# EAGLE schematic sensor-board2 (EAGLE 7.6.0)
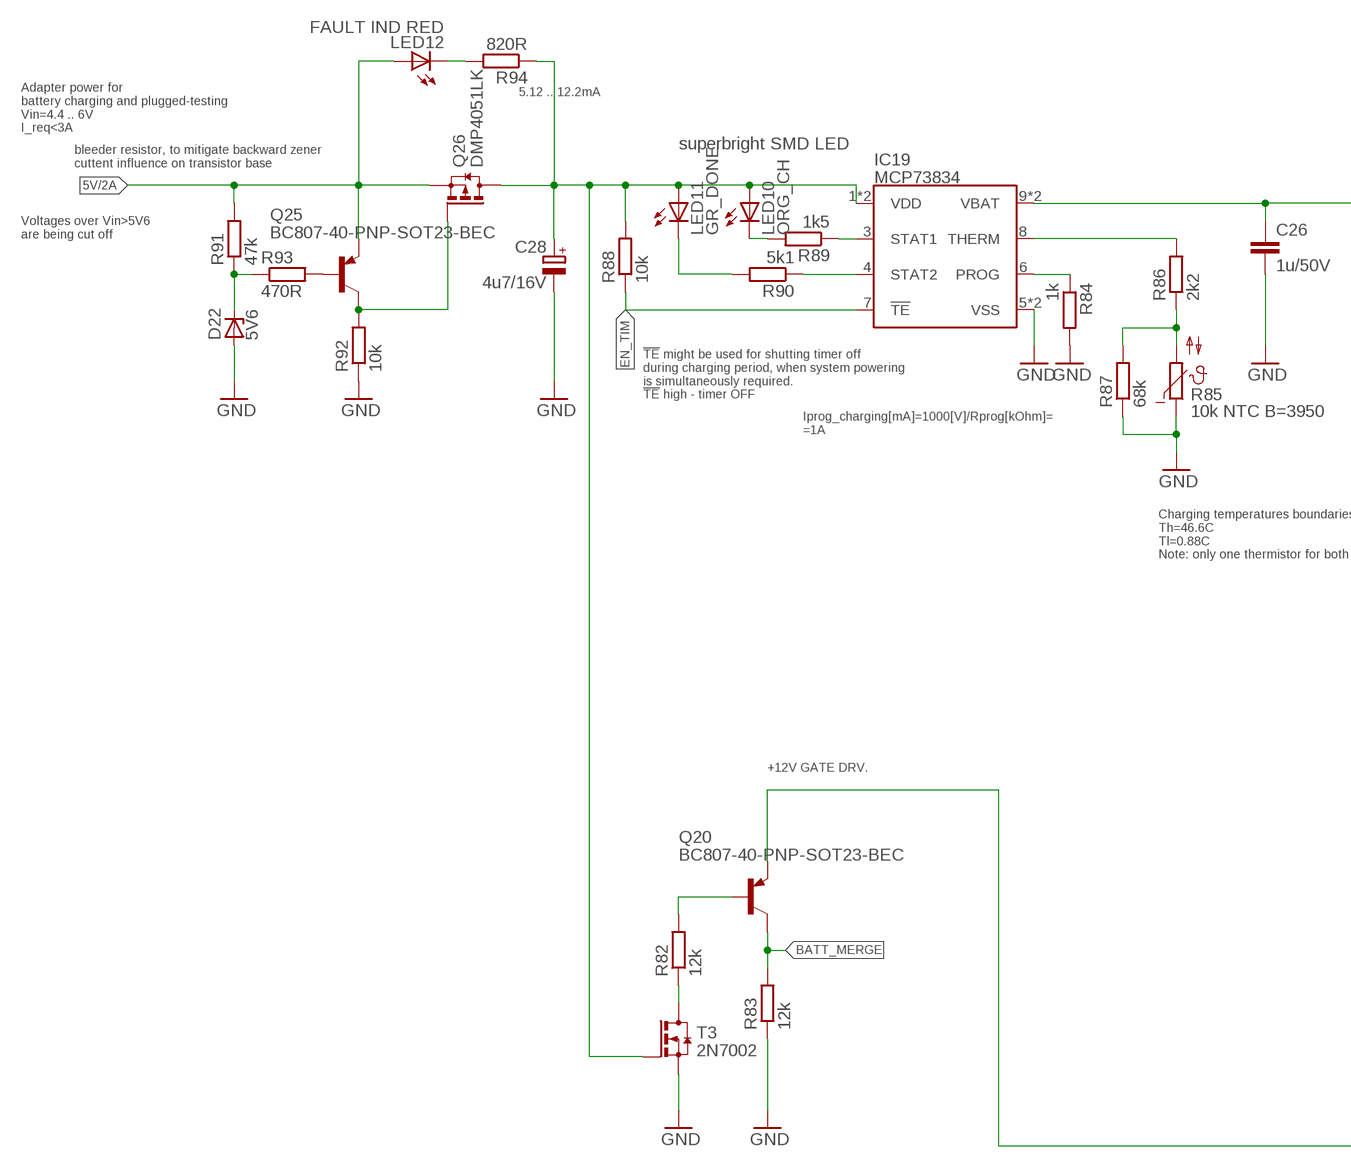
[diagram p0: schematic, sheet 1, part 1 of 3]
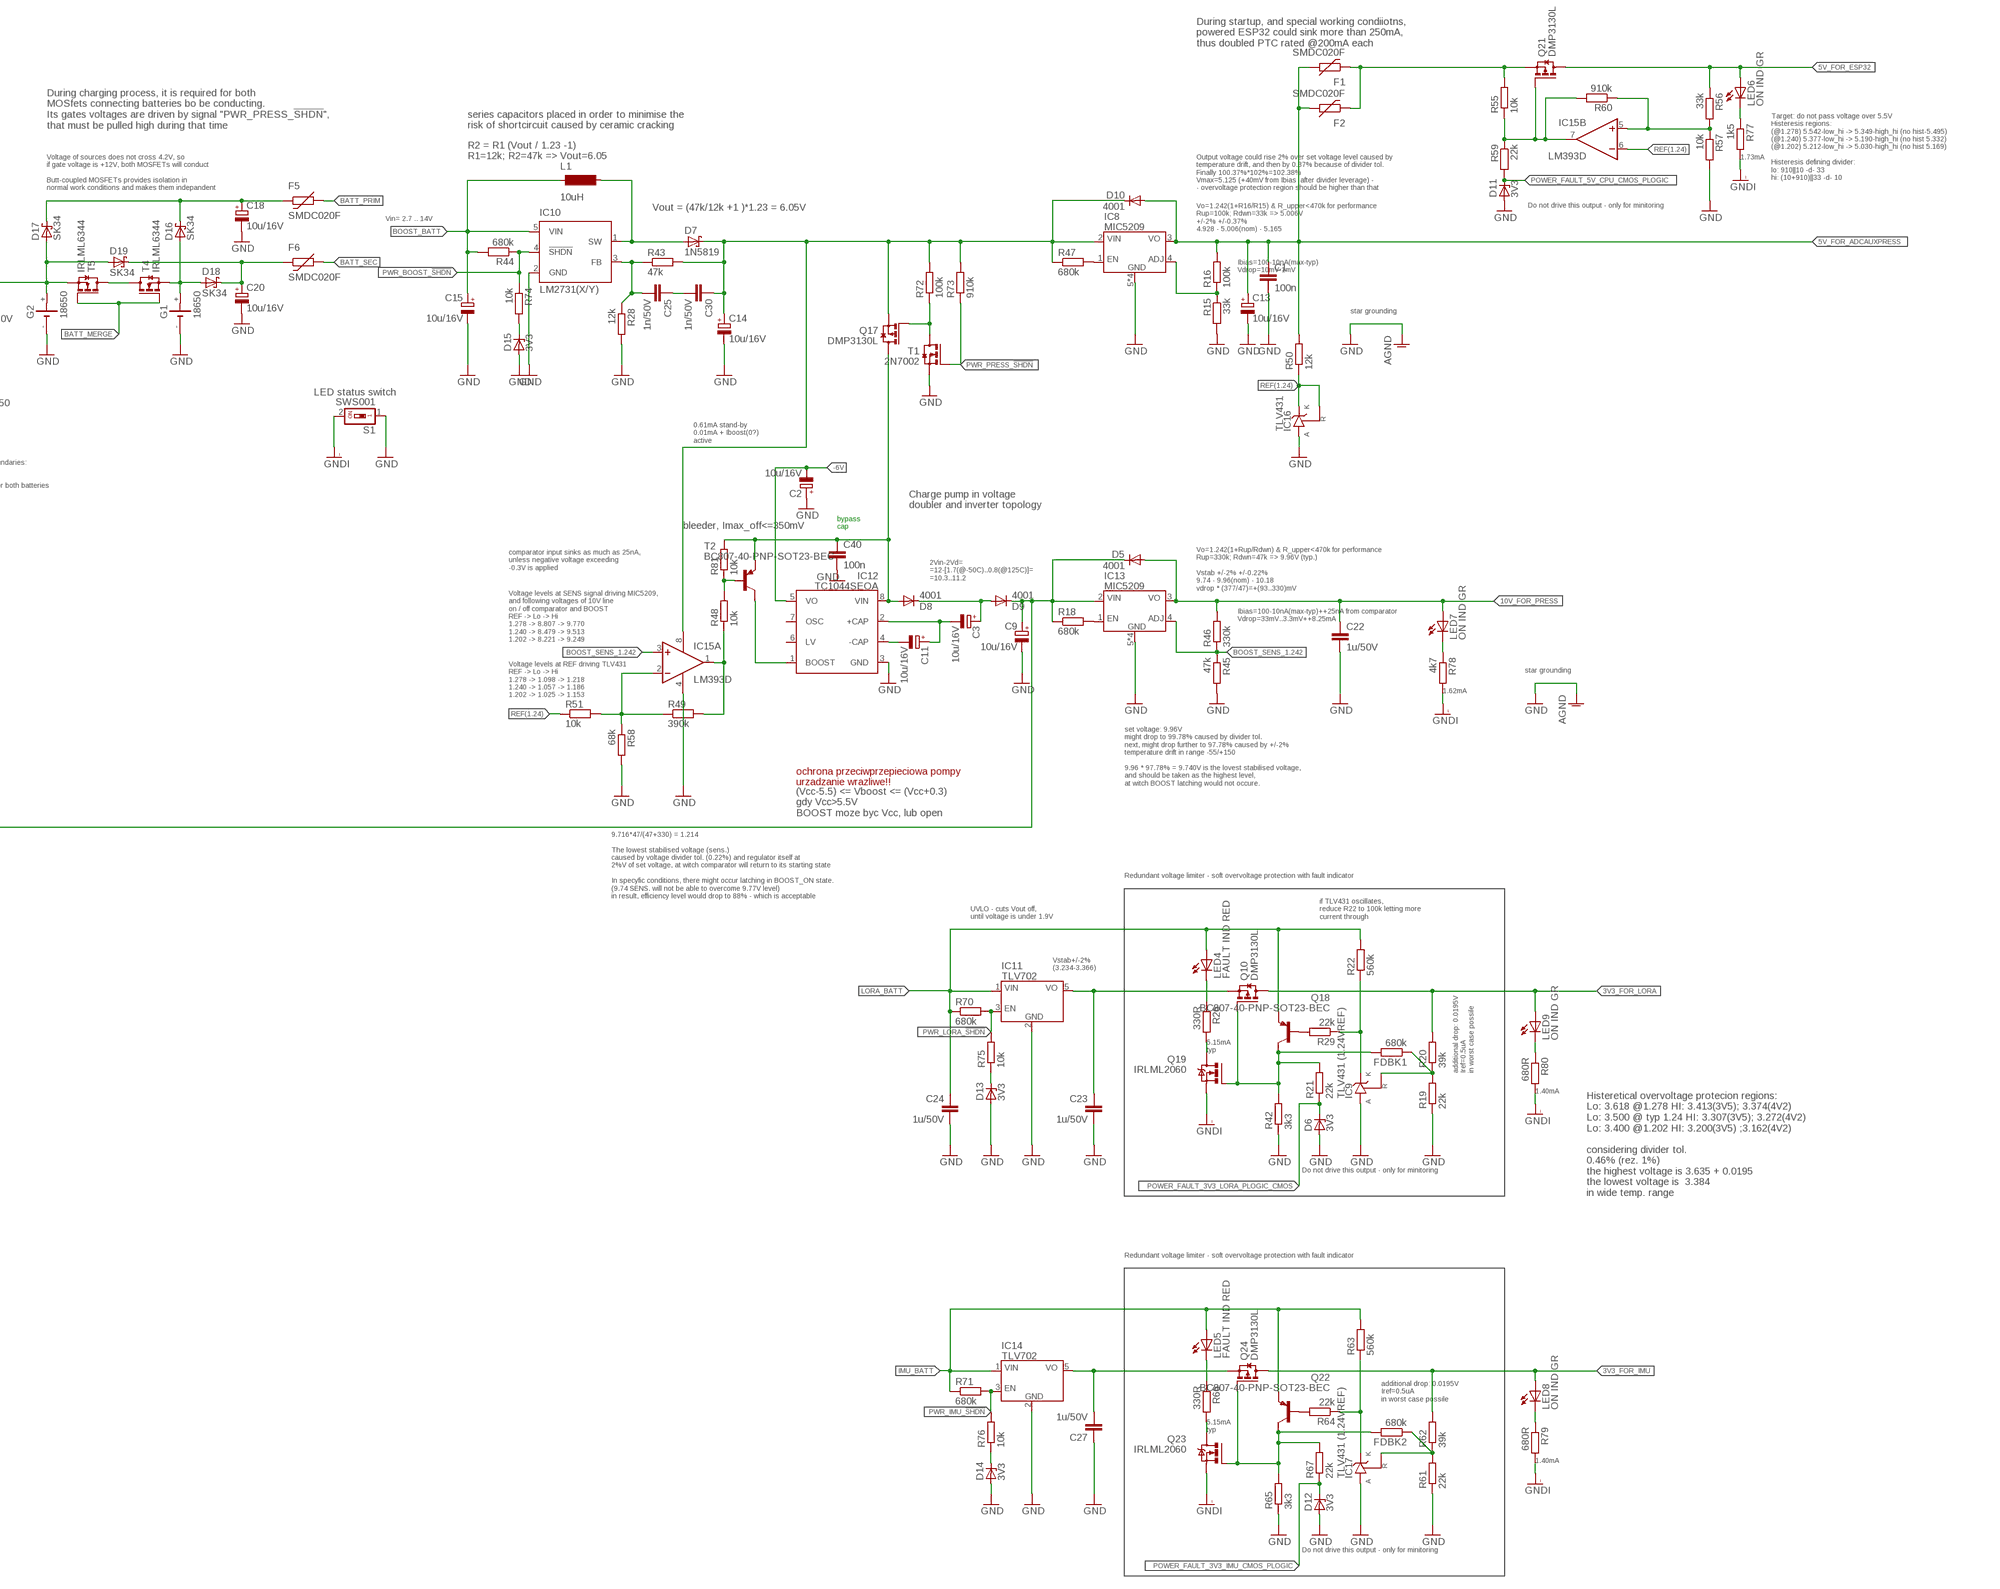
[diagram p1: schematic, sheet 1, part 2 of 3]
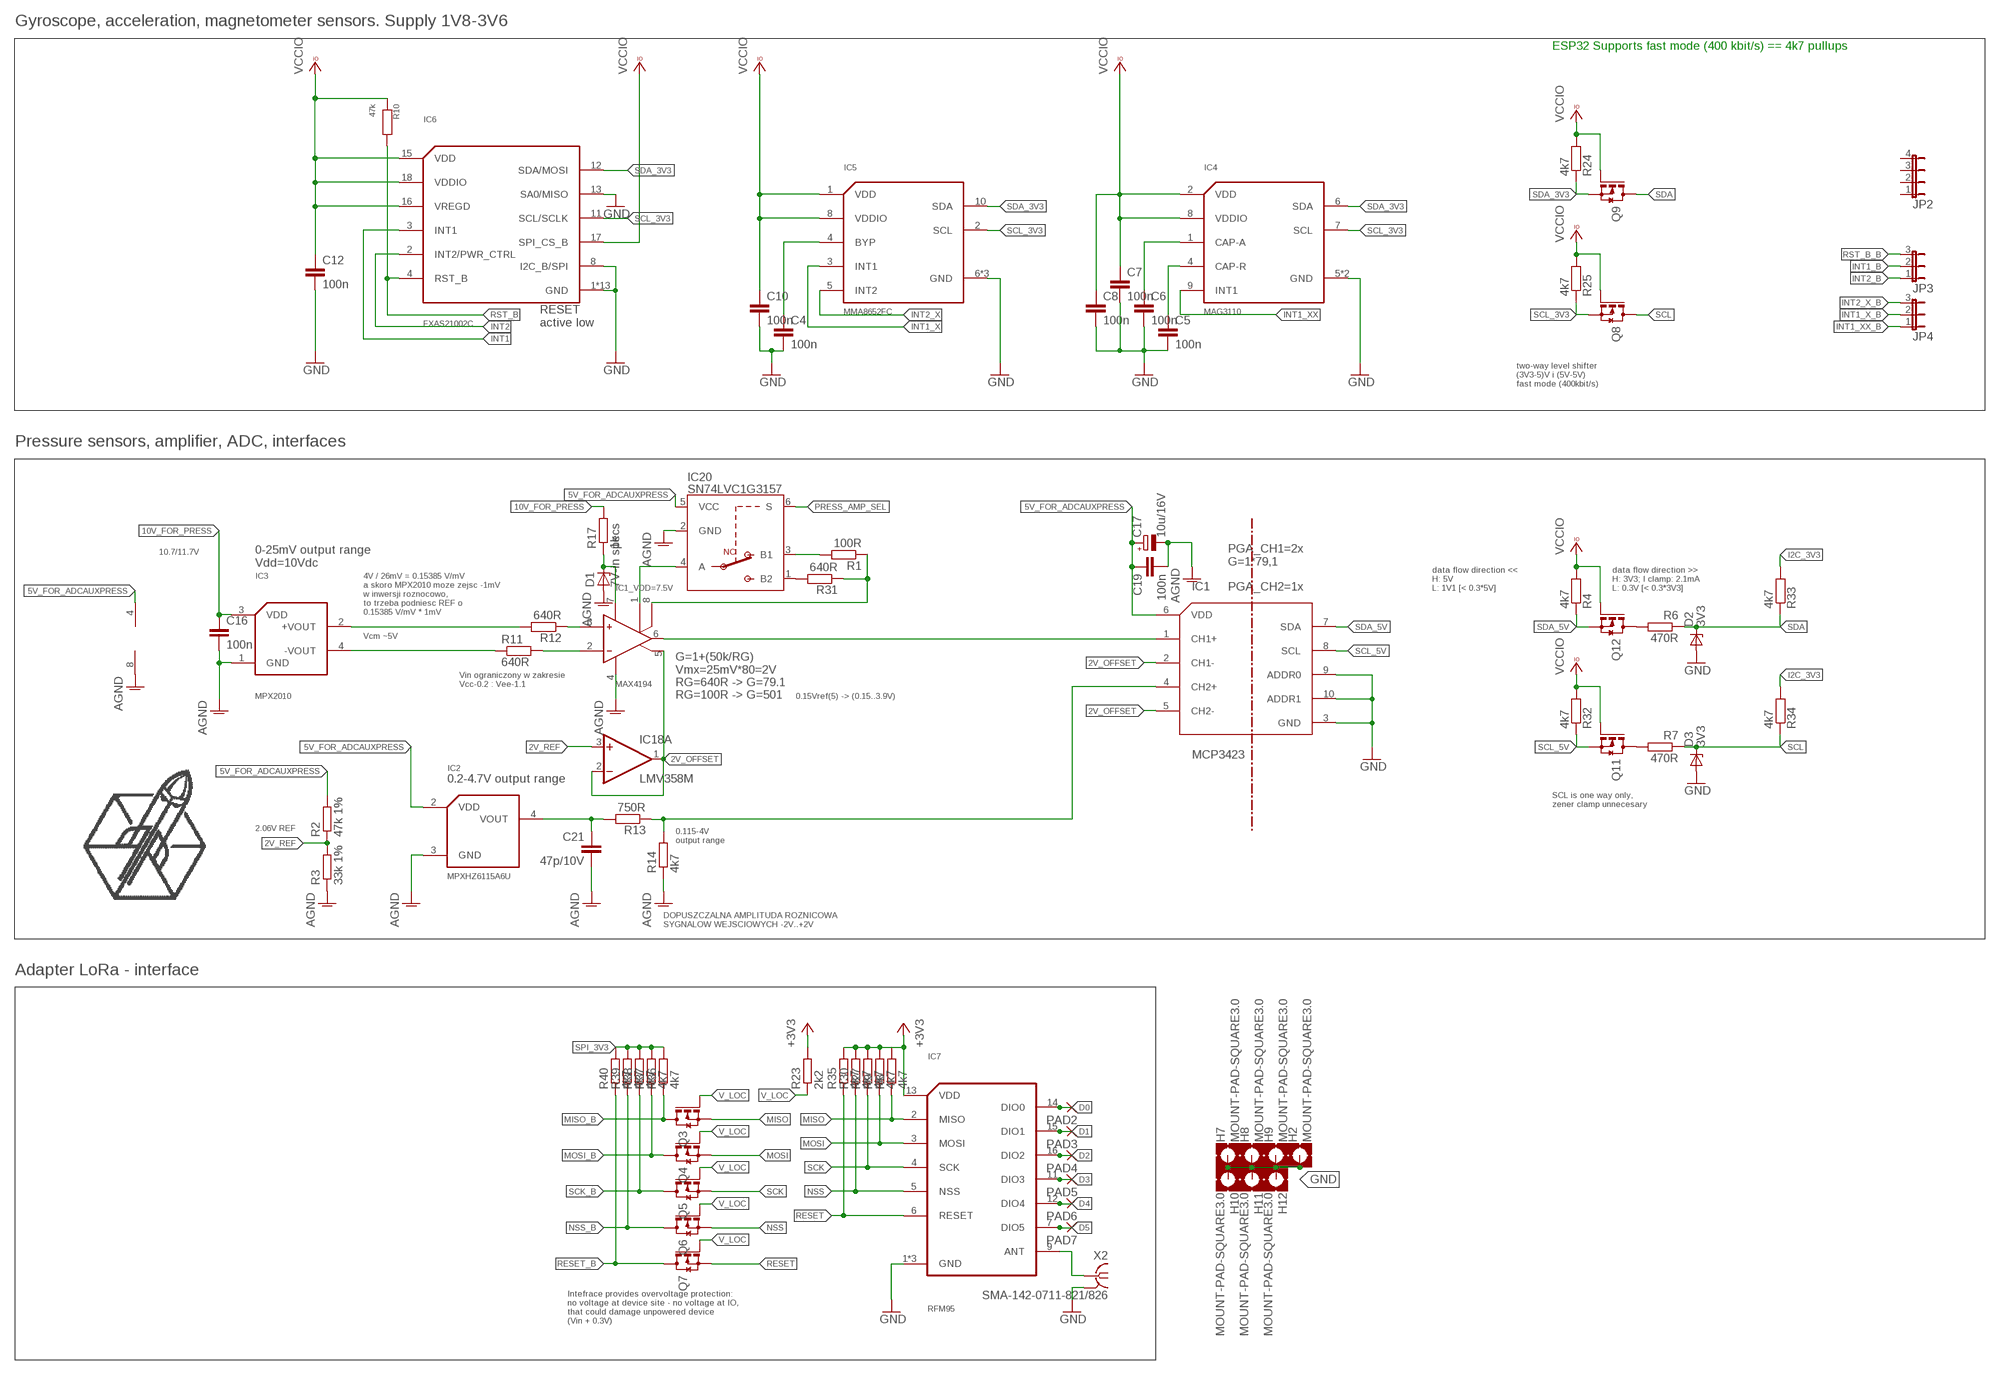
[diagram p2: schematic, sheet 1, part 3 of 3]

## Parts
C1  100n  C-EUC0805  [C0805]
C2  10u/16V  TANTAL_POLY"3218"  [TANTAL"3216"]
C3  10u/16V  TANTAL_POLY"3218"  [TANTAL"3216"]
C4  100n  C-EUC0805  [C0805]
C5  100n  C-EUC0805  [C0805]
C6  100n  C-EUC0805  [C0805]
C7  100n  C-EUC0805  [C0805]
C8  100n  C-EUC0805  [C0805]
C9  10u/16V  TANTAL_POLY"3218"  [TANTAL"3216"]
C10  100n  C-EUC0805  [C0805]
C11  10u/16V  TANTAL_POLY"3218"  [TANTAL"3216"]
C12  100n  C-EUC0805  [C0805]
C13  10u/16V  TANTAL_POLY"3218"  [TANTAL"3216"]
C14  10u/16V  TANTAL_POLY"3218"  [TANTAL"3216"]
C15  10u/16V  TANTAL_POLY"3218"  [TANTAL"3216"]
C16  100n  C-EUC0805  [C0805]
C17  10u/16V  TANTAL_POLY"3218"  [TANTAL"3216"]
C18  10u/16V  TANTAL_POLY"3218"  [TANTAL"3216"]
C19  100n  C-EUC0805  [C0805]
C20  10u/16V  TANTAL_POLY"3218"  [TANTAL"3216"]
C21  47p/10V  C-EUC0805  [C0805]
C22  1u/50V  C-EUC1206  [C1206]
C23  1u/50V  C-EUC1206  [C1206]
C24  1u/50V  C-EUC1206  [C1206]
C25  1n/50V  C-EUC1206  [C1206]
C26  1u/50V  C-EUC1206  [C1206]
C27  1u/50V  C-EUC1206  [C1206]
C28  4u7/16V  TANTAL_POLY"3218"  [TANTAL"3216"]
C30  1n/50V  C-EUC1206  [C1206]
C40  100n  C-EUC0805  [C0805]
D1  7V-in specs  ZENER-DIODESOD80C  [SOD80C]
D2  3V3  1N4148  [SOD323]
D3  3V3  1N4148  [SOD323]
D5  4001  DIODE-DO-214AC  [DO-214AC]
D6  3V3  ZENER-DIODESOD80C  [SOD80C]
D7  1N5819  [MELF-MLL41]
D8  4001  DIODE-DO-214AC  [DO-214AC]
D9  4001  DIODE-DO-214AC  [DO-214AC]
D10  4001  DIODE-DO-214AC  [DO-214AC]
D11  3V3  ZENER-DIODESOD80C  [SOD80C]
D12  3V3  ZENER-DIODESOD80C  [SOD80C]
D13  3V3  ZENER-DIODESOD80C  [SOD80C]
D14  3V3  ZENER-DIODESOD80C  [SOD80C]
D15  3V3  ZENER-DIODESOD80C  [SOD80C]
D16  SK34  [SMA(DO214-AC)]
D17  SK34  [SMA(DO214-AC)]
D18  SK34  [SMA(DO214-AC)]
D19  SK34  [SMA(DO214-AC)]
D22  5V6  ZENER-DIODESOD80C  [SOD80C]
F1  SMDC020F  [1812]
F2  SMDC020F  [1812]
F5  SMDC020F  [1812]
F6  SMDC020F  [1812]
FDBK1  680k  R-EU_R0805  [R0805]
FDBK2  680k  R-EU_R0805  [R0805]
G1  18650  SL-150-1/2AA/PR  [SL-150-1/2AA/PR]
G2  18650  SL-150-1/2AA/PR  [SL-150-1/2AA/PR]
H2  MOUNT-PAD-SQUARE3.0  [3,0-PAD-SQUARE]
H7  MOUNT-PAD-SQUARE3.0  [3,0-PAD-SQUARE]
H8  MOUNT-PAD-SQUARE3.0  [3,0-PAD-SQUARE]
H9  MOUNT-PAD-SQUARE3.0  [3,0-PAD-SQUARE]
H10  MOUNT-PAD-SQUARE3.0  [3,0-PAD-SQUARE]
H11  MOUNT-PAD-SQUARE3.0  [3,0-PAD-SQUARE]
H12  MOUNT-PAD-SQUARE3.0  [3,0-PAD-SQUARE]
IC1  MCP3423  [MSOP10]
IC1_VDD=7.5V  MAX4194  [SO-8]
IC2  MPXHZ6115A6U  [SSOP_CASE_1317]
IC3  MPX2010  [SOP_CASE_482/A]
IC4  MAG3110  [10_PIN_QFN_2X2MM]
IC5  MMA8652FC  [10_PIN_QFN_2X2MM]
IC6  FXAS21002C  [24_QFN_4X4MM]
IC7  RFM95  [RFM95]
IC8  MIC5209  [SOIC8]
IC9  TLV431 (1.24VREF)  TL431-ASA  [SOT23-3]
IC10  LM2731(X/Y)  [SOT23-5]
IC11  TLV702  [SOT23-5]
IC12  TC1044SEOA  [SOIC8]
IC13  MIC5209  [SOIC8]
IC14  TLV702  [SOT23-5]
IC15  LM393D  [SO08]
IC16  TLV431  TL431-ASA  [SOT23-3]
IC17  TLV431 (1.24VREF)  TL431-ASA  [SOT23-3]
IC18  LMV358M  [SO08]
IC19  MCP73834  [DFN10-3X3]
IC20  SN74LVC1G3157  [SC70-6]
JP2  JP4E  [JP4]
JP3  JP2E  [JP2]
JP4  JP2E  [JP2]
L1  10uH  POWER_INDUCTOR  [7X7X4]
LED4  FAULT IND RED  LED_E  [LED_1206]
LED5  FAULT IND RED  LED_E  [LED_1206]
LED6  ON IND GR  LED_E  [LED_1206]
LED7  ON IND GR  LED_E  [LED_1206]
LED8  ON IND GR  LED_E  [LED_1206]
LED9  ON IND GR  LED_E  [LED_1206]
LED10  ORG_CH  LED_E  [LED_1206]
LED11  GR_DONE  LED_E  [LED_1206]
LED12  FAULT IND RED  LED_E  [LED_1206]
PAD2  SMD2  [SMD1,27-2,54]
PAD3  SMD2  [SMD1,27-2,54]
PAD4  SMD2  [SMD1,27-2,54]
PAD5  SMD2  [SMD1,27-2,54]
PAD6  SMD2  [SMD1,27-2,54]
PAD7  SMD2  [SMD1,27-2,54]
Q3  AO3402  [SOT23-3]
Q4  AO3402  [SOT23-3]
Q5  AO3402  [SOT23-3]
Q6  AO3402  [SOT23-3]
Q7  AO3402  [SOT23-3]
Q8  AO3402  [SOT23-3]
Q9  AO3402  [SOT23-3]
Q10  DMP3130L  [SOT23-3]
Q11  AO3402  [SOT23-3]
Q12  AO3402  [SOT23-3]
Q17  DMP3130L  [SOT23-3]
Q18  BC807-40-PNP-SOT23-BEC  [SOT23-BEC]
Q19  IRLML2060  [SOT23-3]
Q20  BC807-40-PNP-SOT23-BEC  [SOT23-BEC]
Q21  DMP3130L  [SOT23-3]
Q22  BC807-40-PNP-SOT23-BEC  [SOT23-BEC]
Q23  IRLML2060  [SOT23-3]
Q24  DMP3130L  [SOT23-3]
Q25  BC807-40-PNP-SOT23-BEC  [SOT23-BEC]
Q26  DMP4051LK  [TO252-3-11]
R1  100R  R-EU_R0805  [R0805]
R2  47k 1%  R-EU_R0805  [R0805]
R3  33k 1%  R-EU_R0805  [R0805]
R4  4k7  R-EU_R0805  [R0805]
R6  470R  R-EU_R0805  [R0805]
R7  470R  R-EU_R0805  [R0805]
R8  4k7  R-EU_R0805  [R0805]
R9  4k7  R-EU_R0805  [R0805]
R10  47k  RESISTOR  [ZWORA@1]
R11  640R  R-EU_R0805  [R0805]
R12  640R  R-EU_R0805  [R0805]
R13  750R  R-EU_R0805  [R0805]
R14  4k7  R-EU_R0805  [R0805]
R15  33k  R-EU_R0805  [R0805]
R16  100k  R-EU_R0805  [R0805]
R17  1k  R-EU_R0805  [R0805]
R18  680k  R-EU_R0805  [R0805]
R19  22k  R-EU_R0805  [R0805]
R20  39k  R-EU_R0805  [R0805]
R21  22k  R-EU_R0805  [R0805]
R22  560k  R-EU_R0805  [R0805]
R23  2k2  R-EU_R0805  [R0805]
R24  4k7  R-EU_R0805  [R0805]
R25  4k7  R-EU_R0805  [R0805]
R26  330R  R-EU_R0805  [R0805]
R27  4k7  R-EU_R0805  [R0805]
R28  12k  R-EU_R0805  [R0805]
R29  22k  R-EU_R0805  [R0805]
R30  4k7  R-EU_R0805  [R0805]
R31  640R  R-EU_R0805  [R0805]
R32  4k7  R-EU_R0805  [R0805]
R33  4k7  R-EU_R0805  [R0805]
R34  4k7  R-EU_R0805  [R0805]
R35  4k7  R-EU_R0805  [R0805]
R36  4k7  R-EU_R0805  [R0805]
R37  4k7  R-EU_R0805  [R0805]
R38  4k7  R-EU_R0805  [R0805]
R39  4k7  R-EU_R0805  [R0805]
R40  4k7  R-EU_R0805  [R0805]
R42  3k3  R-EU_R0805  [R0805]
R43  47k  R-EU_R0805  [R0805]
R44  680k  R-EU_R0805  [R0805]
R45  47k  R-EU_R0805  [R0805]
R46  330k  R-EU_R0805  [R0805]
R47  680k  R-EU_R0805  [R0805]
R48  10k  R-EU_R0805  [R0805]
R49  390k  R-EU_R0805  [R0805]
R50  12k  R-EU_R0805  [R0805]
R51  10k  R-EU_R0805  [R0805]
R55  10k  R-EU_R0805  [R0805]
R56  33k  R-EU_R0805  [R0805]
R57  10k  R-EU_R0805  [R0805]
R58  68k  R-EU_R0805  [R0805]
R59  22k  R-EU_R0805  [R0805]
R60  910k  R-EU_R0805  [R0805]
R61  22k  R-EU_R0805  [R0805]
R62  39k  R-EU_R0805  [R0805]
R63  560k  R-EU_R0805  [R0805]
R64  22k  R-EU_R0805  [R0805]
R65  3k3  R-EU_R0805  [R0805]
R66  330R  R-EU_R0805  [R0805]
R67  22k  R-EU_R0805  [R0805]
R70  680k  R-EU_R0805  [R0805]
R71  680k  R-EU_R0805  [R0805]
R72  100k  R-EU_R0805  [R0805]
R73  910k  R-EU_R0805  [R0805]
R74  10k  R-EU_R0805  [R0805]
R75  10k  R-EU_R0805  [R0805]
R76  10k  R-EU_R0805  [R0805]
R77  1k5  R-EU_R0805  [R0805]
R78  4k7  R-EU_R0805  [R0805]
R79  680R  R-EU_R0805  [R0805]
R80  680R  R-EU_R0805  [R0805]
R81  10k  R-EU_R0805  [R0805]
R82  12k  R-EU_R0805  [R0805]
R83  12k  R-EU_R0805  [R0805]
R84  1k  R-EU_R0805  [R0805]
R85  10k NTC B=3950  NTC640-9  [N640]
R86  2k2  R-EU_R0805  [R0805]
R87  68k  R-EU_R0805  [R0805]
R88  10k  R-EU_R0805  [R0805]
R89  1k5  R-EU_R0805  [R0805]
R90  5k1  R-EU_R0805  [R0805]
R91  47k  R-EU_R0805  [R0805]
R92  10k  R-EU_R0805  [R0805]
R93  470R  R-EU_R0805  [R0805]
R94  820R  R-EU_R0805  [R0805]
S1  SWS001  [SMS-001]
T1  2N7002  [SOT23-3W]
T2  BC807-40-PNP-SOT23-BEC  [SOT23-BEC]
T3  2N7002  [SOT23-3W]
T4  IRLML6344  [SOT23-3W@1]
T5  IRLML6344  [SOT23-3W@1]
X2  SMA-142-0711-821/826  [J502-ND-142-0711-821/826]

## Nets
2V_OFFSET: IC1.2(CH1-) IC1.5(CH2-) IC1_VDD=7.5V.5(REF) IC18.1(A:OUT) IC18.2(A:-IN)
2V_REF: IC18.3(A:+IN) R2.1 R3.2
3V3_FOR_IMU: LED8.A Q24.3(D) R62.2
3V3_FOR_LORA: LED9.A Q10.3(D) R20.2
5V/2A: LED12.A Q25.E Q26.2(S) R91.2
5V_FOR_ADCAUXPRESS: C1.1 C13.+ C17.+ C19.1 D10.A F1.P$2 F2.P$2 IC1.6(VDD) IC2.2(VDD) IC8.3(VO) IC18.4(P:V-) IC20.5(VCC) R2.2 R16.2 R50.2
5V_FOR_ESP32: LED6.A Q21.3(D) R56.1
10V_FOR_PRESS: C16.1 C22.1 D5.A IC3.3(VDD) IC13.3(VO) LED7.A R17.2 R46.2
+3V3: IC7.13(VDD) R23.2
-6V: C2.- IC12.5(VO)
AGND: C16.2 C17.- C19.2 C21.2 D1.A IC1_VDD=7.5V.4(GND) IC2.3(GND) IC3.1(GND) IC18.8(P:V+) IC20.2(GND) R3.1 R14.1
BATT_MERGE: Q20.C R83.2 T4.1(G) T5.1(G)
BATT_PRIM: F5.P$2
BATT_SEC: F6.P$2
BOOST_BATT: C15.+ IC10.5(VIN) L1.1 R44.2
BOOST_SENS_1.242: IC13.4(ADJ) IC15.3(A:+IN) R45.1 R46.1
D0: IC7.14(DIO0) PAD2.1(P)
D1: IC7.15(DIO1) PAD3.1(P)
D2: IC7.16(DIO2) PAD4.1(P)
D3: IC7.11(DIO3) PAD5.1(P)
D4: IC7.12(DIO4) PAD6.1(P)
D5: IC7.7(DIO5) PAD7.1(P)
EN_TIM: IC19.7(!TE!) R88.1
GND: C1.2 C2.+ C4.2 C5.2 C6.2 C7.2 C8.2 C9.- C10.2 C12.2 C13.- C14.- C15.- C18.- C20.- C22.2 C23.2 C24.2 C26.2 C27.1 C28.- C40.2 D2.A D3.A D6.A D11.A D12.A D13.A D14.A D15.A D22.A G1.- G2.- H2.B3,0(MOUNT) H7.B3,0(MOUNT) H8.B3,0(MOUNT) H9.B3,0(MOUNT) H10.B3,0(MOUNT) H11.B3,0(MOUNT) H12.B3,0(MOUNT) IC1.3(GND) IC1.9(ADDR0) IC1.10(ADDR1) IC4.5(GND) IC4.10(GND) IC5.6(GND) IC5.7(GND) IC5.9(GND) IC6.1(GND) IC6.5(GND) IC6.6(GND) IC6.7(GND) IC6.8(I2C_B/SPI) IC6.9(GND) IC6.10(GND) IC6.13(SA0/MISO) IC6.14(GND) IC6.19(GND) IC6.20(GND) IC6.21(GND) IC6.22(GND) IC6.23(GND) IC6.24(GND) IC7.1(GND) IC7.8(GND) IC7.10(GND) IC8.5(GND) IC8.6(GND) IC8.7(GND) IC8.8(GND) IC9.3(A) IC10.2(GND) IC11.2(GND) IC12.3(GND) IC13.5(GND) IC13.6(GND) IC13.7(GND) IC13.8(GND) IC14.2(GND) IC15.4(P:V-) IC16.3(A) IC17.3(A) IC19.5(VSS) IC19.GND(VSS) R15.2 R19.1 R28.2 R42.1 R45.2 R57.2 R58.2 R61.1 R65.1 R83.1 R84.2 R85.1 R87.1 R92.1 S1.1 T1.2(S) T3.2(S) X2.G@1 X2.G@2 X2.G@3 X2.G@4 ; supply symbol labelled AGND
GNDI: Q19.2(S) Q23.2(S) R77.2 R78.2 R79.2 R80.2 S1.2
I2C_3V3: R33.2 R34.2
IMU_BATT: IC14.1(VIN) LED5.A Q22.E R63.2 R71.1
INT1: IC6.3(INT1)
INT1_B: JP3.2
INT1_X: IC5.3(INT1)
INT1_X_B: JP4.2
INT1_XX: IC4.9(INT1)
INT1_XX_B: JP4.1
INT2: IC6.2(INT2/PWR_CTRL)
INT2_B: JP3.1
INT2_X: IC5.5(INT2)
INT2_X_B: JP4.3
LORA_BATT: C24.1 IC11.1(VIN) LED4.A Q18.E R22.2 R70.1
MISO: IC7.2(MISO) Q3.2(S) R8.1
MISO_B: Q3.3(D) R36.1
MOSI: IC7.3(MOSI) Q4.2(S) R9.1
MOSI_B: Q4.3(D) R37.1
N$1: IC1.1(CH1+) IC1_VDD=7.5V.6(VOUT)
N$2: IC8.4(ADJ) R15.1 R16.1
N$3: Q12.3(D) R6.2
N$4: IC1_VDD=7.5V.2(IN-) R11.2
N$5: IC20.1(B2) R31.2
N$6: IC1_VDD=7.5V.1(RG+) IC20.4(A)
N$7: IC3.4(-VOUT) R11.1
N$8: F1.P$1 F2.P$1 Q21.2(S) R55.2
N$9: C5.1 IC4.4(CAP-R)
N$10: C6.1 IC4.1(CAP-A)
N$11: C11.- IC12.4(-CAP)
N$12: Q11.3(D) R7.2
N$13: R8.2 R9.2 R27.2 R30.2 R35.2
N$14: IC7.9(ANT) X2.1
N$15: C21.1 IC2.4(VOUT) R13.2
N$16: C4.1 IC5.4(BYP)
N$17: C40.1 D8.A IC12.8(VIN) Q17.3(D) R81.2 T2.E
N$18: IC1.4(CH2+) R13.1 R14.2
N$19: IC8.1(EN) R47.2
N$20: IC1_VDD=7.5V.3(IN+) R12.1
N$21: IC15.7(B:OUT) Q21.1(G) R55.1 R59.1 R60.2
N$22: C23.1 IC11.5(VO) Q10.2(S)
N$23: R48.2 R81.1 T2.B
N$24: IC20.3(B1) R1.2
N$25: IC3.2(+VOUT) R12.2
N$26: Q17.1(G) R72.1 T1.3(D)
N$27: Q18.B R29.2
N$28: C3.+ D8.C D9.A
N$29: IC15.5(B:+IN) R56.2 R57.1 R60.1
N$30: D7.A IC10.1(SW) L1.2
N$31: C25.2 IC10.3(FB) R28.1 R43.1
N$32: LED4.C R26.1
N$33: D1.C IC1_VDD=7.5V.7(VDD) R17.1
N$34: IC9.2(K) R22.1 R29.1
N$35: IC1_VDD=7.5V.8(RG-) R1.1 R31.1
N$36: C3.- C11.+ IC12.2(+CAP)
N$38: IC15.1(A:OUT) R48.1 R49.2
N$40: Q19.3(D) R26.2
N$43: C14.+ C30.1 D7.C D10.C IC8.2(VIN) IC15.8(P:V+) Q17.2(S) R43.2 R47.1 R72.2 R73.2
N$44: D15.C R74.2
N$45: IC15.2(A:-IN) R49.1 R51.2 R58.1
N$46: IC13.1(EN) R18.2
N$48: D13.C R75.1
N$50: FDBK1.1 IC9.1(R) R19.2 R20.1
N$52: Q22.B R64.2
N$53: IC17.2(K) R63.1 R64.1
N$54: LED5.C R66.1
N$55: Q23.3(D) R66.2
N$56: C27.2 IC14.5(VO) Q24.2(S)
N$57: FDBK2.1 IC17.1(R) R61.2 R62.1
N$59: C26.1 D17.A D19.A G2.+ IC19.9(VBAT) IC19.10(VBAT) T5.2(S)
N$61: D14.C R76.1
N$62: C25.1 C30.2
N$63: D16.A D18.A G1.+ T4.2(S)
N$64: C18.+ D16.C D17.C F5.P$1
N$65: C20.+ D18.C D19.C F6.P$1
N$66: C28.+ IC19.1(VDD) IC19.2(VDD) LED10.A LED11.A Q26.3(D) R88.2 R94.1 T3.1(G)
N$69: LED6.C R77.1
N$70: LED7.C R78.1
N$71: LED8.C R79.1
N$72: LED9.C R80.1
N$73: T4.3(D) T5.3(D)
N$74: IC12.1(BOOST) T2.C
N$75: R82.1 T3.3(D)
N$76: Q20.B R82.2
N$77: C9.+ D5.C D9.C IC13.2(VIN) Q20.E R18.1
N$79: D22.C R91.1 R93.1
N$80: IC19.4(STAT2) R90.1
N$81: R85.2 R86.1 R87.2
N$82: IC19.6(PROG) R84.1
N$83: IC19.8(THERM) R86.2
N$84: LED10.C R89.2
N$85: IC19.3(STAT1) R89.1
N$86: Q25.C Q26.1(G) R92.2
N$87: LED11.C R90.2
N$89: Q25.B R93.2
N$91: LED12.C R94.2
NSS: IC7.5(NSS) Q6.2(S) R30.1
NSS_B: Q6.3(D) R39.1
POWER_FAULT_3V3_IMU_CMOS_PLOGIC: D12.C R67.1
POWER_FAULT_3V3_LORA_PLOGIC_CMOS: D6.C R21.1
POWER_FAULT_5V_CPU_CMOS_PLOGIC: D11.C R59.2
PRESS_AMP_SEL: IC20.6(S)
PWR_BOOST_!SHDN!: IC10.4(!SHDN!) R44.1 R74.1
PWR_IMU_!SHDN!: IC14.3(EN) R71.2 R76.2
PWR_LORA_!SHDN!: IC11.3(EN) R70.2 R75.2
PWR_PRESS_!SHDN!: R73.1 T1.1(G)
REF(1.24): IC15.6(B:-IN) IC16.1(R) IC16.2(K) R50.1 R51.1
REHREH: FDBK1.2 Q10.1(G) Q18.C Q19.1(G) R21.2 R42.2
REHREH1: FDBK2.2 Q22.C Q23.1(G) Q24.1(G) R65.2 R67.2
RESET: IC7.6(RESET) Q7.2(S) R35.1
RESET_B: Q7.3(D) R40.1
RST_B: IC6.4(RST_B) R10.2
RST_B_B: JP3.3
SCK: IC7.4(SCK) Q5.2(S) R27.1
SCK_B: Q5.3(D) R38.1
SCL: D3.C(K) Q8.3(D) R7.1 R34.1
SCL_3V3: IC4.7(SCL) IC5.2(SCL) IC6.11(SCL/SCLK) Q8.2(S) R25.1
SCL_5V: IC1.8(SCL) Q11.2(S) R32.1
SDA: D2.C(K) Q9.3(D) R6.1 R33.1
SDA_3V3: IC4.6(SDA) IC5.10(SDA) IC6.12(SDA/MOSI) Q9.2(S) R24.1
SDA_5V: IC1.7(SDA) Q12.2(S) R4.1
SPI_3V3: R36.2 R37.2 R38.2 R39.2 R40.2
V_LOC: Q3.1(G) Q4.1(G) Q5.1(G) Q6.1(G) Q7.1(G) R23.1
VCCIO: C7.1 C8.1 C10.1 C12.1 IC4.2(VDD) IC4.8(VDDIO) IC5.1(VDD) IC5.8(VDDIO) IC6.15(VDD) IC6.16(VREGD) IC6.17(SPI_CS_B) IC6.18(VDDIO) Q8.1(G) Q9.1(G) Q11.1(G) Q12.1(G) R4.2 R10.1 R24.2 R25.2 R32.2
Unconnected: IC12.6(LV) IC12.7(OSC) IC18.5(B:+IN) IC18.6(B:-IN) IC18.7(B:OUT) JP2.1 JP2.2 JP2.3 JP2.4

## Notes on the sheet
- Gyroscope, acceleration, magnetometer sensors. Supply 1V8-3V6
- ESP32 Supports fast mode (400 kbit/s) == 4k7 pullups
- During startup, and special working condiiotns,
  powered ESP32 could sink more than 250mA,
  thus doubled PTC rated @200mA each
- During charging process, it is required for both
  MOSfets connecting batteries bo be conducting.
  Its gates voltages are driven by signal "PWR_PRESS_!SHDN!",
  that must be pulled high during that time
- series capacitors placed in order to minimise the
  risk of shortcircuit caused by ceramic cracking
- R2 = R1 (Vout / 1.23 -1) 
  R1=12k; R2=47k => Vout=6.05
- 1.73mA
- Target: do not pass voltage over 5.5V
  Histeresis regions:
  (@1.278) 5.542-low_hi -> 5.349-high_hi (no hist-5.495)
  (@1.240) 5.377-low_hi -> 5.190-high_hi (no hist 5.332)
  (@1.202) 5.212-low_hi -> 5.030-high_hi (no hist 5.169)
  
  Histeresis defining divider:
  lo: 910||10 -d- 33
  hi: (10+910)||33 -d- 10
- Voltage of sources does not cross 4.2V, so
  if gate voltage is +12V, both MOSFETs will conduct
  
  Butt-coupled MOSFETs provides isolation in
  normal work conditions and makes them indepandent
- Output voltage could rise 2% over set voltage level caused by 
  temperature drift, and then by 0.37% because of divider tol. 
  Finally 100.37%*102%=102.38%
  Vmax=5.125 (+40mV from Ibias  after divider leverage) -
  - overvoltage protection region should be higher than that
- Do not drive this output - only for minitoring
- Vout = (47k/12k +1 )*1.23 = 6.05V
- 5.12 .. 12.2mA | Vin= 2.7 .. 14V
- Vo=1.242(1+R16/R15) & R_upper<470k for performance
  Rup=100k; Rdwn=33k => 5.006V
  +/-2% +/-0.37%
  4.928 - 5.006(nom) - 5.165
- Adapter power for 
  battery charging and plugged-testing
  Vin=4.4 .. 6V
  I_req<3A
- superbright SMD LED
- bleeder resistor, to mitigate backward zener
  cuttent influence on transistor base
- Ibias=100-10nA(max-typ)
  Vdrop=10mV-1mV
- RESET
  active low
- Voltages over Vin>5V6 
  are being cut off
- star grounding
- two-way level shifter
  (3V3-5)V i (5V-5V)
  fast mode (400kbit/s)
- Pressure sensors, amplifier, ADC, interfaces
- !TE! might be used for shutting timer off
  during charging period, when system powering
  is simultaneously required.
  !TE! high - timer OFF
- LED status switch
- Iprog_charging[mA]=1000[V]/Rprog[kOhm]=
  =1A
- 0.61mA stand-by
  0.01mA + Iboost(0?)
  active
- 10.7/11.7V
- 0-25mV output range
  Vdd=10Vdc
- Charging temperatures boundaries:
  Th=46.6C
  Tl=0.88C
  Note: only one thermistor for both batteries
- PGA_CH1=2x
  G=1*79,1
  
  PGA_CH2=1x
- data flow direction <<
  H: 5V
  L: 1V1 [< 0.3*5V]
- data flow direction >>
  H: 3V3; I clamp: 2.1mA
  L: 0.3V [< 0.3*3V3]
- Charge pump in voltage 
  doubler and inverter topology
- 4V / 26mV = 0.15385 V/mV
  a skoro MPX2010 moze zejsc -1mV 
  w inwersji roznocowo, 
  to trzeba podniesc REF o 
  0.15385 V/mV * 1mV
- bleeder, Imax_off<=350mV
- bypass
  cap
- Vcm ~5V
- Vo=1.242(1+Rup/Rdwn) & R_upper<470k for performance
  Rup=330k; Rdwn=47k => 9.96V (typ.)
- comparator input sinks as much as 25nA,
  unless negative voltage exceeding 
  -0.3V is applied
- 2Vin-2Vd=
  =12-[1.7(@-50C)..0.8(@125C)]=
  =10.3..11.2
- Vin ograniczony w zakresie
  Vcc-0.2 : Vee-1.1
- Vstab +/-2% +/-0.22%
  9.74 - 9.96(nom) - 10.18
  vdrop * (377/47)=+(93..330)mV
- G=1+(50k/RG)
  Vmx=25mV*80=2V
  RG=640R -> G=79.1
  RG=100R -> G=501
- 0.15Vref(5) -> (0.15..3.9V)
- +12V GATE DRV.
- Ibias=100-10nA(max-typ)++25nA from comparator
  Vdrop=33mV..3.3mV++8.25mA
- Voltage levels at SENS signal driving MIC5209,
  and following voltages of 10V line
  on / off comparator and BOOST
  REF -> Lo -> Hi
  1.278 -> 8.807 -> 9.770
  1.240 -> 8.479 -> 9.513
  1.202 -> 8.221 -> 9.249
- 0.2-4.7V output range
- star grounding
- SCL is one way only, 
  zener clamp unnecesary
- 1.62mA
- Voltage levels at REF driving TLV431
  REF -> Lo -> Hi
  1.278 -> 1.098 -> 1.218
  1.240 -> 1.057 -> 1.186
  1.202 -> 1.025 -> 1.153
- 2.06V REF
- 0.115-4V 
  output range
- ochrona przeciwprzepieciowa pompy
  urzadzanie wrazliwe!!
- set voltage: 9.96V
  might drop to 99.78% caused by divider tol.
  next, might drop further to 97.78% caused by +/-2%
  temperature drift in range -55/+150
  
  9.96 * 97.78% = 9.740V is the lovest stabilised voltage, 
  and should be taken as the highest level, 
  at witch BOOST latching would not occure.
- DOPUSZCZALNA AMPLITUDA ROZNICOWA
  SYGNALOW WEJSCIOWYCH -2V..+2V
- (Vcc-5.5) <= Vboost <= (Vcc+0.3)
  gdy Vcc>5.5V
  BOOST moze byc Vcc, lub open
- Adapter LoRa - interface
- Redundant voltage limiter - soft overvoltage protection with fault indicator
- 9.716*47/(47+330) = 1.214
  
  The lowest stabilised voltage (sens.)
  caused by voltage divider tol. (0.22%) and regulator itself at 
  2%V of set voltage, at witch comparator will return to its starting state
  
  In specyfic conditions, there might occur latching in BOOST_ON state.
  (9.74 SENS. will not be able to overcome 9.77V level)
  in result, efficiency level would drop to 88% - which is acceptable
- UVLO - cuts Vout off, 
  until voltage is under 1.9V
- if TLV431 oscillates,
  reduce R22 to 100k letting more 
  current through
- Vstab+/-2%
  (3.234-3.366)
- 5.15mA 
  typ
- additional drop: 0.0195V
  Iref=0.5uA
  in worst case possile
- 1.40mA
- Intefrace provides overvoltage protection:
  no voltage at device site - no voltage at IO, 
  that could damage unpowered device 
  (Vin + 0.3V)
- Do not drive this output - only for minitoring
- Histeretical overvoltage protecion regions:
  Lo: 3.618 @1.278 HI: 3.413(3V5); 3.374(4V2)
  Lo: 3.500 @ typ 1.24 HI: 3.307(3V5); 3.272(4V2)
  Lo: 3.400 @1.202 HI: 3.200(3V5) ;3.162(4V2)
  
  considering divider tol.
  0.46% (rez. 1%)
  the highest voltage is 3.635 + 0.0195
  the lowest voltage is  3.384
  in wide temp. range
- Redundant voltage limiter - soft overvoltage protection with fault indicator
- additional drop: 0.0195V
  Iref=0.5uA
  in worst case possile
- 5.15mA 
  typ
- 1.40mA
- Do not drive this output - only for minitoring

## Library data of the parts
C1 C4-C8 C10 C12 C16 C19 C21-C27 C30 C40 = rcl:C-EU: CAPACITOR, European symbol
C2 C3 C9 C11 C13-C15 C17 C18 C20 C28 = TI:TANTAL_POLY"3218": Yellow aliexpress tantal/polymer capacitor 4u7/16V; 10u/16V
D1 D6 D11-D15 D22 = diode:ZENER-DIODE: Z-Diode
D2 D3 = TI:1N4148
D5 D8-D10 = diode:DIODE-: DIODE
D7 = diode:1N5819: SCHOTTKY RECTIFIER 40V 1A MELF 2.6 x 5
D16-D19 = miscrel:SK34: Schottky barrier rectifier diode 3A, 40V
F1 F2 F5 F6 = PolyFuse:SMDC020F: Polymeric Positive Coefficient Thermistor (PolyFuse) 0.2A / 30V
FDBK1 FDBK2 R1-R4 R6-R9 R11-R40 R42-R51 R55-R67 R70-R84 R86-R94 = resistor:R-EU_: RESISTOR, European symbol
G1 G2 = battery:SL-150-1/2AA/PR: LI BATTERY Sonnenschein
H2 H7-H12 = holes:MOUNT-PAD-SQUARE: MOUNTING PAD, square
IC1 = analog-devices:MCP3423: 18-Bit, Multi-Channel delta-Sigma Analog-to-Digital Converter with I2C™ Interface and On-Board Reference 240SPS @12bit
IC1_VDD=7.5V = MAX:MAX4194: MAX4194 Micropower, Single-Supply, Rail-to-Rail, Precision Instrumentation Amplifiers The MAX4194 is a variable-gain precision instrumentation amplifier that combines Rail-to-Rail; single-supply operation, outstanding precision specifications, and a high gain bandwidth.
IC2 = freescale_sensors:MPXHZ6115A6U: Silicon Pressure Sensor MPXHZ6115A6U Media Resistant and High Temperature Accuracy Integrated Silicon Pressure Sensor for Measuring Absolute Pressure, On-Chip Signal Conditioned, Temperature Compensated and Calibrated
IC3 = freescale_sensors:MPX2010: MPX2010 10 kPa On-Chip Temperature Compensated and Calibrated Silicon Pressure Sensors The MPX2010 series silicon piezoresisti ve pressure sensors provide a very accurate and linear voltage output directly proportional to the applied pressure. These sensors house a single monolithic silicon die with the strain gauge and thin film resistor network integrated. The sensor is laser trimmed for precise span, offset calibration and temperature compensation.
IC4 = freescale_sensors:MAG3110: Xtrinsic MAG3110 Three-Axis, Digital Magnetometer 2x2x0.8mm QFN The MAG3110 is capable of measuring magnetic fields with an output data rate (ODR) up to 80 Hz; these output data rates correspond to sample intervals from 12.5 ms to several seconds.
IC5 = freescale_sensors:MMA8652FC: MMA8652FC, 3-Axis, 12-bit, Digital Accelerometer The MMA8652FC is an intelligent, low-power, three-axis, capacitive micromachined accelerometer with 12 bits of resolution. This acce lerometer is packed with embedded functions with flexible user-programmable options, configurable to two interrupt pins
IC6 = freescale_sensors:FXAS21002C: 3-Axis Digital Angular Rate Gyroscope FXAS21002C FXAS21002C is a small, low-power, yaw, pitch, and roll angular rate gyroscope with 16 bit ADC resolution. The full-scale range is adjustable from ±250°/s to ±2000°/s. It features both I2C and SPI interfaces.
IC7 = freescale_sensors:RFM95: RFM95/96/97/98(W) - Low Power Long Ra nge Transceiver Module The RFM95/96/97/98(W) transceivers feature the LoRa TM long range modem that provides ultra-long range spread spectrum communication and high interference immunity whilst minimising current consumption.
IC8 IC13 = TI:MIC5209: MIC5209 Microchip extremely LDO 300mA linear regulator
IC9 IC16 IC17 = TI:TL431-ASA: Reference voltage source with ultra low current (100uA) Vref=1.24 typ.
IC10 = TI:LM2731(X/Y): Power switching boost converter dc-dc fc= 0.6MHz (X)/ 1.6MHz (Y)
IC11 IC14 = TI:TLV702: TLV701-3V3 is a LDO 3V3 linear voltage regulator 320mA 250mV drop
IC12 = TI:TC1044SEOA: Charge pump DC-DC converter, doubler, inverter 20mA, 1.5-12Vin
IC15 = linear:LM393: COMPARATOR
IC18 = linear:LMV358?*: Dual General Purpose, Low Voltage, Rail-to-Rail Output Operational Amplifiers Source: http://www.national.com/mpf/LM/LMV321.html http://www.national.com/dt/lmv_qual.pdf
IC19 = microchip:MCP73834: Stand-Alone Linear Li-Ion / Li-Polymer Charge Management Controller Vdd 6V/ I 1A
IC20 = TI:SN74LVC1G3157: Single-Pole Double-Throw Analog Switch
JP2 = jumper:JP4E: JUMPER
JP3 JP4 = jumper:JP2E: JUMPER
L1 = miscrel:POWER_INDUCTOR: SMD power inductor in shielded casing 7x7x4mm well suited for DC-DC converters
LED4-LED12 = eagle-ltspice:LED_E: LED Source: http://www.osram.convergy.de Source: www.luxeon.com Source: www.kingbright.com; SPICEMODEL: NONE; SPICEPREFIX: D; SPICETYPE: diode
PAD2-PAD7 = wirepad:SMD2: SMD PAD
Q3-Q9 Q11 Q12 = TI:AO3402: N-MOS 30V logic level
Q10 Q17 Q21 Q24 = miscrel:DMP3130L: small P-MOS SOT23-3 100mOhm rds-on
Q18 Q20 Q22 Q25 T2 = transistor:*-PNP-: PNP Transistror
Q19 Q23 = miscrel:IRLML2060: N-MOS logic level transistor
Q26 = miscrel:DMP4051LK: Power P-MOS TO252-3 <100mOhm rds-on
R10 = freescale_sensors:RESISTOR: SMD RESISTOR IN 1206 PACKAGE CUSTOM LANDPAD
R85 = ptc-ntc:NTC640-9: PHILIPS NTC; OC_FARNELL: unknown; OC_NEWARK: unknown
S1 = smd-special:SWS001: SMD Dip Switch 1 pol.
T1 T3 = TI:2N7002: Low quality N-MOS for logic level function Rds_on>8Ohm; 60V/3A
T4 T5 = TI:IRLML6344: IRLML6344 High quality N-MOS Rds_on <40mOhm; I<4A
X2 = con-coax:SMA-: SMA 50 Ohm End Launch Jack Receptacle - Round Contact Johnson Components Source: www.johnsoncomponents.com .. J502-ND.pdf; MF: JOHNSON COMPONENTS; MPN: 142-0711-821; OC_FARNELL: 1019328; OC_NEWARK: 16F3627